# Altium schematic sheet RTD.SchDoc: RTD analog interface
size A3; Author: M. Gumiela, G. Gajoch; DocumentNumber: 2; SheetNumber: 2; SheetTotal: 16; Model: EM1; PageSetup: Record=PageOptions|CenterHorizontal=True|CenterVertical=True|PrintScale=0.52|XCorrection=1.00|YCorrection=1.00|PrintKind=1|BorderSize=5000000|LeftOffset=0|BottomOffset=0|Orientation=2|PaperLength=4200|PaperWidth=2970|Scale=100|PaperSource=7|PrintQuality=600|MediaType=1|DitherType=10|PaperKind=A3|PrintScaleMode=1
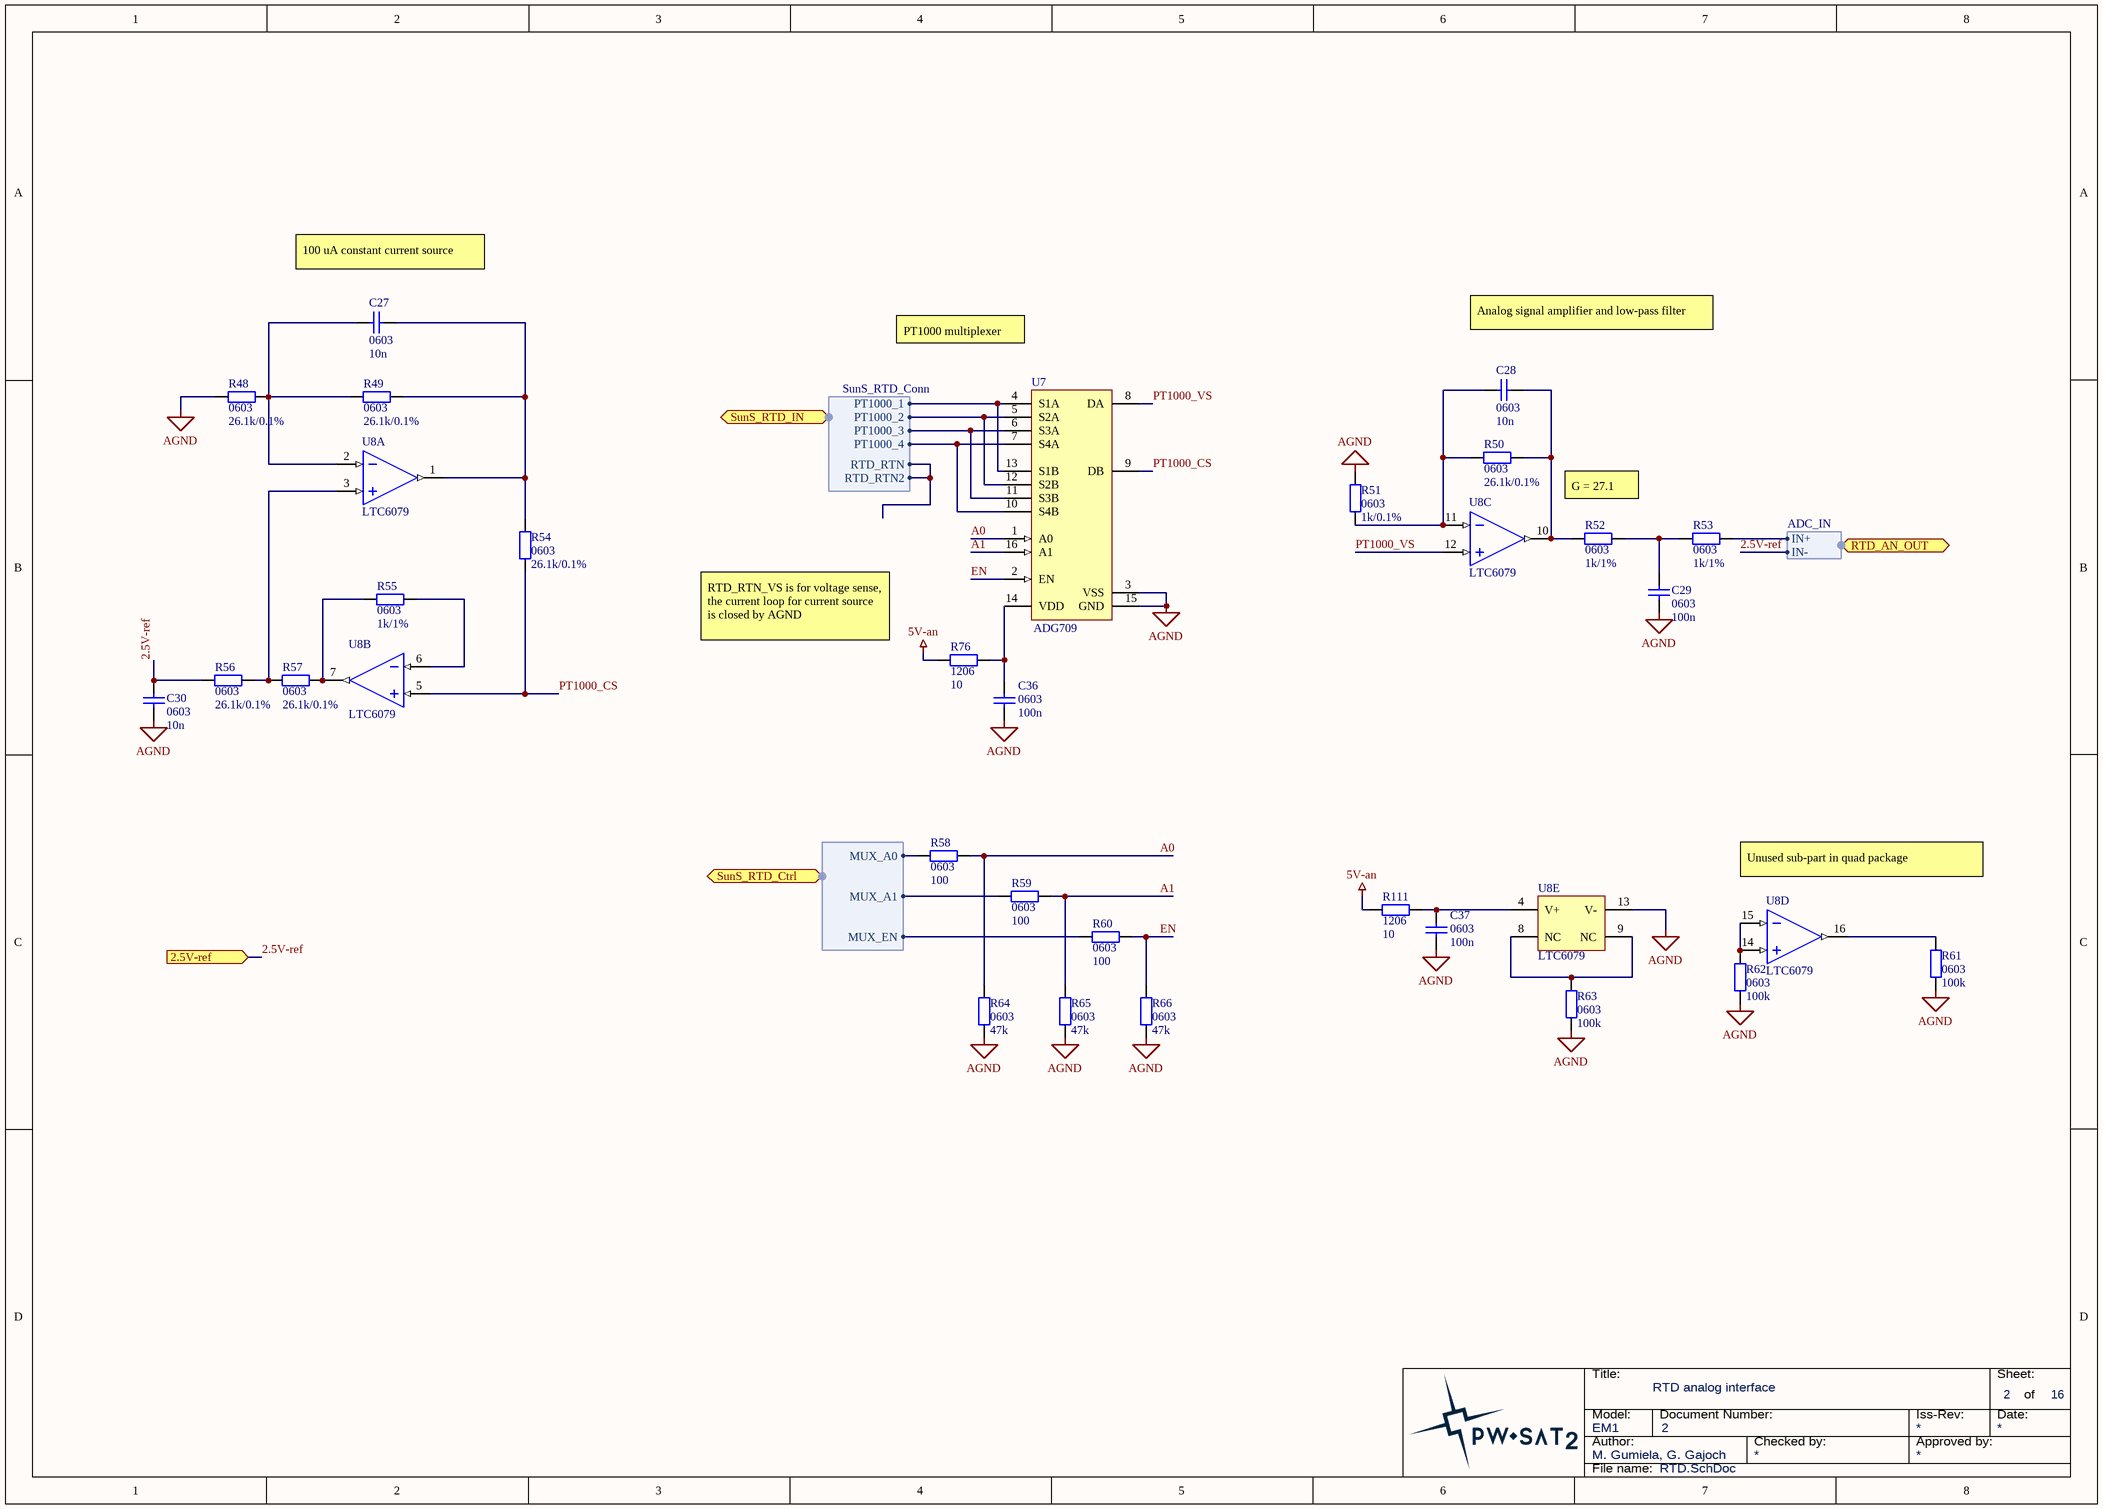
[diagram p0: RTD.SchDoc]

## Parts
C27  0603  value 10n  [SMD_Capacitor_0603]
C28  0603  value 10n  [SMD_Capacitor_0603]
C29  0603  value 100n  [SMD_Capacitor_0603]
C30  0603  value 10n  [SMD_Capacitor_0603]
C36  0603  value 100n  [SMD_Capacitor_0603]
C37  0603  value 100n  [SMD_Capacitor_0603]
R48  0603  value 26.1k/0.1%  [SMD_Resistor_0603]
R49  0603  value 26.1k/0.1%  [SMD_Resistor_0603]
R50  0603  value 26.1k/0.1%  [SMD_Resistor_0603]
R51  0603  value 1k/0.1%  [SMD_Resistor_0603]
R52  0603  value 1k/1%  [SMD_Resistor_0603]
R53  0603  value 1k/1%  [SMD_Resistor_0603]
R54  0603  value 26.1k/0.1%  [SMD_Resistor_0603]
R55  0603  value 1k/1%  [SMD_Resistor_0603]
R56  0603  value 26.1k/0.1%  [SMD_Resistor_0603]
R57  0603  value 26.1k/0.1%  [SMD_Resistor_0603]
R58  0603  value 100  [SMD_Resistor_0603]
R59  0603  value 100  [SMD_Resistor_0603]
R60  0603  value 100  [SMD_Resistor_0603]
R61  0603  value 100k  [SMD_Resistor_0603]
R62  0603  value 100k  [SMD_Resistor_0603]
R63  0603  value 100k  [SMD_Resistor_0603]
R64  0603  value 47k  [SMD_Resistor_0603]
R65  0603  value 47k  [SMD_Resistor_0603]
R66  0603  value 47k  [SMD_Resistor_0603]
R76  1206  value 10  [SMD_Resistor_1206]
R111  1206  value 10  [SMD_Resistor_1206]
U7  ADG709  [TSSOP16]
U8  LTC6079  [SSOP-16]  (parts A,B,C,D,E of 5)

## Ports
2.5V-ref (in), RTD_AN_OUT (harness ADC_IN), SunS_RTD_Ctrl (harness MUX_Control), SunS_RTD_IN (harness SunS_RTD_Conn)

## Harnesses
MUX_Control: MUX_A0, MUX_A1, MUX_EN
ADC_IN: IN+, IN-
SunS_RTD_Conn: PT1000_1, PT1000_2, PT1000_3, PT1000_4, RTD_RTN2, RTD_RTN

## Nets
5V-an: R76.2 R111.2
AGND: C29.1 C30.2 C36.1 C37.1 R48.2 R51.1 R61.2 R62.2 R63.2 R64.2 R65.2 R66.2 U7.3(VSS) U7.15(GND) U8.13(V-)
2.5V-ref: C30.1 R56.2 ; port 2.5V-ref, port RTD_AN_OUT.IN-
A0: R58.1 R64.1 U7.1(A0)
A1: R59.1 R65.1 U7.16(A1)
EN: R60.1 R66.1 U7.2(EN)
PT1000_CS: R54.1 U7.9(DB) U8.5(IN+_B)
PT1000_VS: U7.8(DA) U8.12(IN+_C)
NetC27_1: C27.1 R48.1 R49.2 U8.2(IN-_A)
NetC27_2: C27.2 R49.1 R54.2 U8.1(OUT_A)
NetC28_1: C28.1 R50.1 R51.2 U8.11(IN-_C)
NetC28_2: C28.2 R50.2 R52.2 U8.10(OUT_C)
NetC29_2: C29.2 R52.1 R53.2
NetC36_2: C36.2 R76.1 U7.14(VDD)
NetC37_2: C37.2 R111.1 U8.4(V+)
NetR53_1: R53.1 ; port RTD_AN_OUT.IN+
NetR55_1: R55.1 U8.6(IN-_B)
NetR55_2: R55.2 R57.1 U8.7(OUT_B)
NetR56_1: R56.1 R57.2 U8.3(IN+_A)
NetR58_2: R58.2 ; port SunS_RTD_Ctrl.MUX_A0
NetR59_2: R59.2 ; port SunS_RTD_Ctrl.MUX_A1
NetR60_2: R60.2 ; port SunS_RTD_Ctrl.MUX_EN
NetR61_1: R61.1 U8.16(OUT_D)
NetR62_1: R62.1 U8.14(IN+_D) U8.15(IN-_D)
NetR63_1: R63.1 U8.8(NC) U8.9(NC)
NetU7_4: U7.4(S1A) U7.13(S1B) ; port SunS_RTD_IN.PT1000_1
NetU7_5: U7.5(S2A) U7.12(S2B) ; port SunS_RTD_IN.PT1000_2
NetU7_6: U7.6(S3A) U7.11(S3B) ; port SunS_RTD_IN.PT1000_3
NetU7_7: U7.7(S4A) U7.10(S4B) ; port SunS_RTD_IN.PT1000_4
(unnamed): port SunS_RTD_IN.RTD_RTN2, port SunS_RTD_IN.RTD_RTN

## Notes on the sheet
- 100 uA constant current source
- PT1000 multiplexer
- Analog signal amplifier and low-pass filter
- G = 27.1
- RTD_RTN_VS is for voltage sense, the current loop for current source is closed by AGND
- Unused sub-part in quad package
- Title:
- Sheet:
- of
- Author:
- Model:
- Document Number:
- Checked by:
- Iss-Rev:
- Approved by:
- Date:
- File name:

## Library data of the parts
C27-C30 = Cap: Capacitor; Published: 8-Jun-2000; LatestRevisionDate: 17-Jul-2002; LatestRevisionNote: Re-released for DXP Platform.; PackageReference: RAD-0.3; Publisher: Altium Limited; PackageDescription: Radial Cap, Thru-Hole; 2 Leads; 0.3 in Pin Spacing
C36 C37 = Cap1: Capacitor; Published: 8-Jun-2000; LatestRevisionDate: 17-Jul-2002; LatestRevisionNote: Re-released for DXP Platform.; PackageReference: RAD-0.3; Publisher: Altium Limited; PackageDescription: Radial Cap, Thru-Hole; 2 Leads; 0.3 in Pin Spacing
R48-R66 R76 R111 = Res2: Resistor; Published: 8-Jun-2000; LatestRevisionDate: 17-Jul-2002; LatestRevisionNote: Re-released for DXP Platform.; PackageReference: AXIAL-0.4; Publisher: Altium Limited; PackageDescription: Axial Device, Thru-Hole; 2 Leads; 0.4 in Pin Spacing
U7 = ADG709: CMOS Analog 4-Channel Multiplexer; Manufacturer: Analog Devices; ManufacturerPartNumber: ADG709
U8 = LTC6079: Rail-to-rail, quad operational amplifier. Library compatible with LTC608X LTC607X op-amps; Manufacturer: Linear Technology; Value: LTC6079